# Altium schematic sheet Driver.SchDoc
size 420 x 297 mm
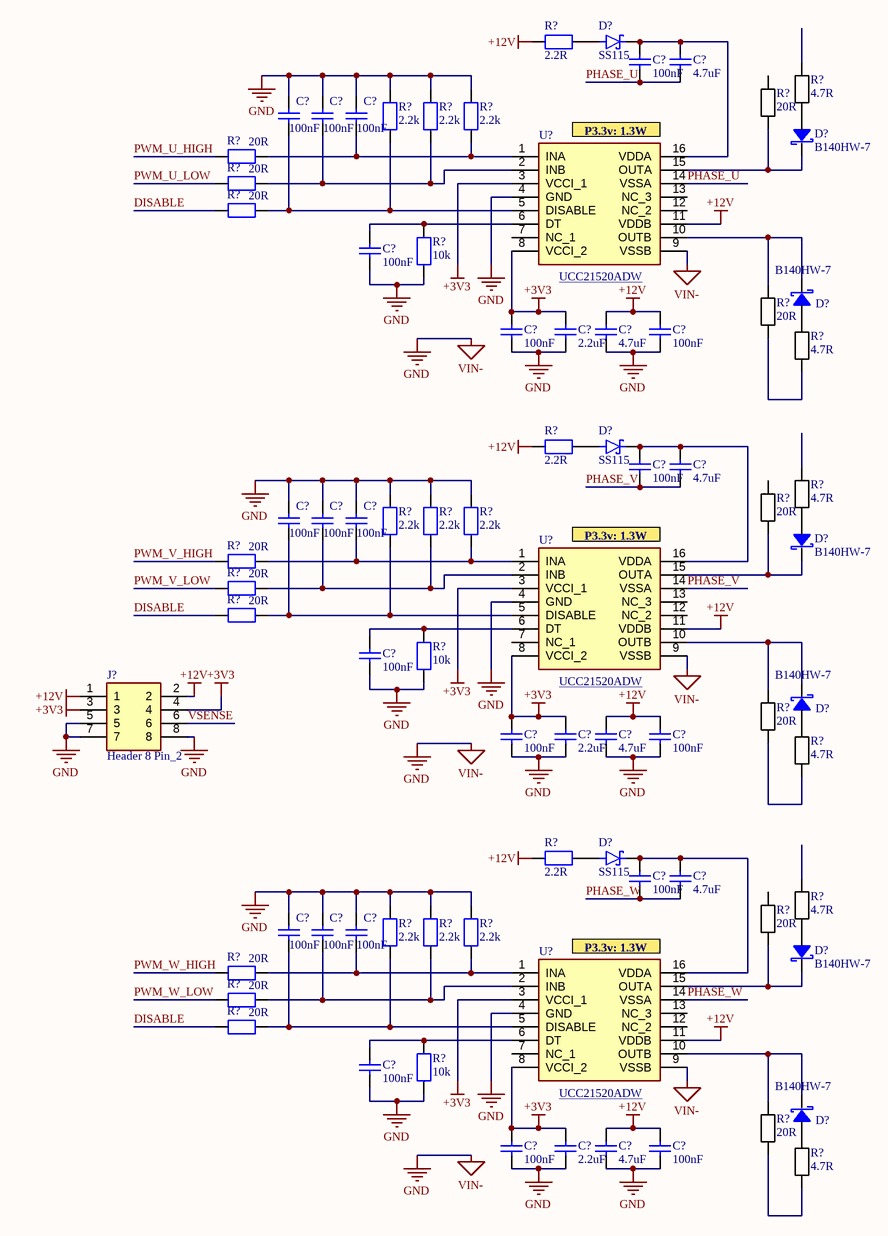
[diagram p0: Driver.SchDoc]

## Parts
(Parts that share a designator on the sheet are numbered #1, #2 ... from top to bottom, then left to right.)
C?#1  100nF  [C0402]
C?#2  4.7uF  [C0603]
C?#3  100nF  [C0402]
C?#4  100nF  [C0402]
C?#5  100nF  [C0402]
C?#6  100nF  [C0402]
C?#7  100nF  [C0402]
C?#8  2.2uF  [C0603]
C?#9  4.7uF  [C0603]
C?#10  100nF  [C0402]
C?#11  100nF  [C0402]
C?#12  4.7uF  [C0603]
C?#13  100nF  [C0402]
C?#14  100nF  [C0402]
C?#15  100nF  [C0402]
C?#16  100nF  [C0402]
C?#17  100nF  [C0402]
C?#18  2.2uF  [C0603]
C?#19  4.7uF  [C0603]
C?#20  100nF  [C0402]
C?#21  100nF  [C0402]
C?#22  4.7uF  [C0603]
C?#23  100nF  [C0402]
C?#24  100nF  [C0402]
C?#25  100nF  [C0402]
C?#26  100nF  [C0402]
C?#27  100nF  [C0402]
C?#28  2.2uF  [C0603]
C?#29  4.7uF  [C0603]
C?#30  100nF  [C0402]
D?#1  SS115  [DIOM4325X250N]
D?#2  B140HW-7  [SOD123]
D?#3  B140HW-7  [SOD123]
D?#4  SS115  [DIOM4325X250N]
D?#5  B140HW-7  [SOD123]
D?#6  B140HW-7  [SOD123]
D?#7  SS115  [DIOM4325X250N]
D?#8  B140HW-7  [SOD123]
D?#9  B140HW-7  [SOD123]
J?  Header 8 Pin_2  [61300821121]
R?#1  2.2R  [R1206]
R?#2  4.7R  [R1206]
R?#3  20R  [R1206]
R?#4  2.2k  [R0603]
R?#5  2.2k  [R0603]
R?#6  2.2k  [R0603]
R?#7  20R  [R1206]
R?#8  20R  [R1206]
R?#9  20R  [R1206]
R?#10  10k  [R0603]
R?#11  20R  [R1206]
R?#12  4.7R  [R1206]
R?#13  2.2R  [R1206]
R?#14  4.7R  [R1206]
R?#15  20R  [R1206]
R?#16  2.2k  [R0603]
R?#17  2.2k  [R0603]
R?#18  2.2k  [R0603]
R?#19  20R  [R1206]
R?#20  20R  [R1206]
R?#21  20R  [R1206]
R?#22  10k  [R0603]
R?#23  20R  [R1206]
R?#24  4.7R  [R1206]
R?#25  2.2R  [R1206]
R?#26  4.7R  [R1206]
R?#27  20R  [R1206]
R?#28  2.2k  [R0603]
R?#29  2.2k  [R0603]
R?#30  2.2k  [R0603]
R?#31  20R  [R1206]
R?#32  20R  [R1206]
R?#33  20R  [R1206]
R?#34  10k  [R0603]
R?#35  20R  [R1206]
R?#36  4.7R  [R1206]
U?#1  UCC21520ADW  [SOIC127P1030X265-16N]
U?#2  UCC21520ADW  [SOIC127P1030X265-16N]
U?#3  UCC21520ADW  [SOIC127P1030X265-16N]

## Nets
+3V3: C?#7.2 C?#8.2 C?#17.2 C?#18.2 C?#27.2 C?#28.2 J?.3 J?.4 U?#1.3(VCCI_1) U?#1.8(VCCI_2) U?#2.3(VCCI_1) U?#2.8(VCCI_2) U?#3.3(VCCI_1) U?#3.8(VCCI_2)
+12V: C?#9.2 C?#10.2 C?#19.2 C?#20.2 C?#29.2 C?#30.2 J?.1 J?.2 R?#1.1 R?#13.1 R?#25.1 U?#1.11(VDDB) U?#2.11(VDDB) U?#3.11(VDDB)
GND: C?#3.2 C?#4.2 C?#5.2 C?#6.1 C?#7.1 C?#8.1 C?#9.1 C?#10.1 C?#13.2 C?#14.2 C?#15.2 C?#16.1 C?#17.1 C?#18.1 C?#19.1 C?#20.1 C?#23.2 C?#24.2 C?#25.2 C?#26.1 C?#27.1 C?#28.1 C?#29.1 C?#30.1 J?.5 J?.7 J?.8 R?#4.2 R?#5.2 R?#6.2 R?#10.1 R?#16.2 R?#17.2 R?#18.2 R?#22.1 R?#28.2 R?#29.2 R?#30.2 R?#34.1 U?#1.4(GND) U?#1.9(VSSB) U?#2.4(GND) U?#2.9(VSSB) U?#3.4(GND) U?#3.9(VSSB)  [also labelled VIN-]
DISABLE: R?#9.1 R?#21.1 R?#33.1
PHASE_U: C?#1.1 C?#2.1 U?#1.14(VSSA)
PHASE_V: C?#11.1 C?#12.1 U?#2.14(VSSA)
PHASE_W: C?#21.1 C?#22.1 U?#3.14(VSSA)
PWM_U_HIGH: R?#7.1
PWM_U_LOW: R?#8.1
PWM_V_HIGH: R?#19.1
PWM_V_LOW: R?#20.1
PWM_W_HIGH: R?#31.1
PWM_W_LOW: R?#32.1
VSENSE: J?.6
NetC?#1_2: C?#1.2 C?#2.2 D?#1.C(K) U?#1.16(VDDA)
NetC?#3_1: C?#3.1 R?#4.1 R?#9.2 U?#1.5(DISABLE)
NetC?#4_1: C?#4.1 R?#5.1 R?#8.2 U?#1.2(INB)
NetC?#5_1: C?#5.1 R?#6.1 R?#7.2 U?#1.1(INA)
NetC?#6_2: C?#6.2 R?#10.2 U?#1.6(DT)
NetC?#11_2: C?#11.2 C?#12.2 D?#4.C(K) U?#2.16(VDDA)
NetC?#13_1: C?#13.1 R?#16.1 R?#21.2 U?#2.5(DISABLE)
NetC?#14_1: C?#14.1 R?#17.1 R?#20.2 U?#2.2(INB)
NetC?#15_1: C?#15.1 R?#18.1 R?#19.2 U?#2.1(INA)
NetC?#16_2: C?#16.2 R?#22.2 U?#2.6(DT)
NetC?#21_2: C?#21.2 C?#22.2 D?#7.C(K) U?#3.16(VDDA)
NetC?#23_1: C?#23.1 R?#28.1 R?#33.2 U?#3.5(DISABLE)
NetC?#24_1: C?#24.1 R?#29.1 R?#32.2 U?#3.2(INB)
NetC?#25_1: C?#25.1 R?#30.1 R?#31.2 U?#3.1(INA)
NetC?#26_2: C?#26.2 R?#34.2 U?#3.6(DT)
NetD?#1_A: D?#1.A R?#1.2
NetD?#2_A: D?#2.A R?#2.1
NetD?#2_C: D?#2.C R?#3.1 U?#1.15(OUTA)
NetD?#3_A: D?#3.A R?#12.2
NetD?#3_C: D?#3.C R?#11.2 U?#1.10(OUTB)
NetD?#4_A: D?#4.A R?#13.2
NetD?#5_A: D?#5.A R?#14.1
NetD?#5_C: D?#5.C R?#15.1 U?#2.15(OUTA)
NetD?#6_A: D?#6.A R?#24.2
NetD?#6_C: D?#6.C R?#23.2 U?#2.10(OUTB)
NetD?#7_A: D?#7.A R?#25.2
NetD?#8_A: D?#8.A R?#26.1
NetD?#8_C: D?#8.C R?#27.1 U?#3.15(OUTA)
NetD?#9_A: D?#9.A R?#36.2
NetD?#9_C: D?#9.C R?#35.2 U?#3.10(OUTB)
NetR?#11_1: R?#11.1 R?#12.1
NetR?#23_1: R?#23.1 R?#24.1
NetR?#35_1: R?#35.1 R?#36.1

Not connected (* = marked no-connect by the designer): R?#2 2; R?#3 2; R?#14 2; R?#15 2; R?#26 2; R?#27 2; U?#1 7(NC_1) 12(NC_2) 13(NC_3); U?#2 7(NC_1) 12(NC_2) 13(NC_3); U?#3 7(NC_1) 12(NC_2) 13(NC_3)

## Notes on the sheet
- (near U?#1) P3.3v: 1.3W
- (near U?#2) P3.3v: 1.3W
- (near U?#3) P3.3v: 1.3W
- THIS DOCUMENT AND THE DATA DISCLOSED HEREIN OR
- HEREWITH IS THE PROPERTY OF ALTIUM LIMITED AND MAY
- DWG NO:
- REVISION
- REV:
- DESCRIPTION
- DATE
- APPROVED
- BE FREELY DISTRIBUTED IN WHOLE. NO RIGHTS ARE
- RESERVED OR EXPRESS OR IMPLIED WARANTEE GIVEN.
- ENG:
- APPROVALS
- PROJECT
- DSN:
- CHK:
- REFERENCE DOCUMENTS
- PROJECT REVISION:
- TITLE
- DOCUMENT REVISION:
- DESIGN ITEM:
- BOM:
- FAB DWG:
- PCB DWG:
- ASSY DWG:
- SCALE:
- A3
- SIZE
- CAGE CODE
- FILE NAME
- DWG NO.
- SHEET
- OF
- REV

## Library data of the parts
C?#1 C?#3-C?#7 C?#10 C?#11 C?#13-C?#17 C?#20 C?#21 C?#23-C?#27 C?#30 = 100nF ± 10% 50V: Manufacturer: Yageo; Manufacturer Part Number: CS0603KRX7R9BB104; Value: 100nF; Supplier: mouser; Supplier Part Number: 603-CS0603KRX79BB104; Price: 0.1
C?#2 C?#9 C?#12 C?#19 C?#22 C?#29 = 4.7uF ± 10% 50V: Manufacturer: Yageo; Manufacturer Part Number: GRM188R61H225ME11J; Value: 4.7uF; Supplier: mouser; Supplier Part Number: 81-GRM188R61H225ME1J; Price: 0.3
C?#8 C?#18 C?#28 = 2.2uF ± 10% 50V: Manufacturer: Yageo; Manufacturer Part Number: GRM188R61H225ME11J; Value: 2.2uF; Supplier: mouser; Supplier Part Number: 81-GRM188R61H225ME1J; Price: 0.3
D?#1 D?#4 D?#7 = SS115: Schottky Diodes & Rectifiers 1A, 150V, Schottky Rectifier; Manufacturer: Taiwan Semiconductor; Value: 1A, 150V; Price: 0.34; Supplier: Mouser; Manufacturer Part Number: SS115; Supplier Part Number: 821-SS115
D?#2 D?#3 D?#5 D?#6 D?#8 D?#9 = B140HW-7: Schottky Diodes & Rectifiers 1A, 40V; Value: B140HW-7; Manufacturer Part Number: B140HW-7; Manufacturer: Diodes; Supplier: Mouser; Supplier Part Number: 621-B140HW-7; Price: 0.42
J? = Header 8 Pin_2: Headers & Wire Housings WR-PHD 2.54mm Hdr 8P Dual Str Gold; Manufacturer: Wurth Elektronik; Value: 61300821121; Supplier Part Number: 710-61300621121; Supplier: Mouser; Manufacturer Part Number: 61300821121; Price: 0.7
R?#1 R?#13 R?#25 = 2.2ohm 0.25W ±1%: 2.2 ohm 0.25W ±1%; Manufacturer Part Number: RC1206FR-072R2L; Manufacturer: Yageo; Value: 2.2R; Supplier: Mouser; Supplier Part Number: 603-RC1206FR-072R2L; Price: 0.12
R?#2 R?#12 R?#14 R?#24 R?#26 R?#36 = 4.7 ohm 0.25W ±1%: Manufacturer Part Number: RC1206FR-074R7L; Manufacturer: Yageo; Value: 4.7R; Supplier: Mouser; Supplier Part Number: 603-RC1206FR-074R7L; Price: 0.12
R?#3 R?#11 R?#15 R?#23 R?#27 R?#35 = 20 ohm 0.25W ±1%: Manufacturer Part Number: RC1206FR-0720RL; Manufacturer: Yageo; Value: 20R; Supplier: Mouser; Supplier Part Number: 603-RC1206FR-0720RL; Price: 0.12
R?#4-R?#6 R?#16-R?#18 R?#28-R?#30 = 2.2 kOhms ±1% 0.1W: Manufacturer: Yageo; Manufacturer Part Number: RC0603FR-072K2L; Value: 2.2k; Supplier: Mouser; Supplier Part Number: 603-RC0603FR-072K2L; Price: 0.1
R?#7-R?#9 R?#19-R?#21 R?#31-R?#33 = 20ohm 0.25W ±1%: 20 ohm 0.25W ±1%; Manufacturer Part Number: RC1206FR-0720RL; Manufacturer: Yageo; Value: 20R; Supplier: Mouser; Supplier Part Number: 603-RC1206FR-0720RL; Price: 0.12
R?#10 R?#22 R?#34 = 10 kOhms ±1% 0.1W: Manufacturer: Yageo; Manufacturer Part Number: RC0603FR-0710KL; Value: 10k; Supplier: mouser; Supplier Part Number: 603-RC0603FR-0710KL; Price: 0.1
U?#1-U?#3 = UCC21520ADW: 4A/6A, 5.7 kVrms Isolated Dual Channel Gate Driver; Manufacturer: Texas Instruments; Supplier Part Number: 595-UCC21520ADW; Value: UCC21520ADW; Manufacturer Part Number: UCC21520ADW; Price: 7.6; Supplier: Mouser